# Altium project EinsyRetro.PrjPcb (part 2 of 2)

## Sheet Motor-X.SchDoc: Motor-X
size Letter; SheetNumber: 8; SheetTotal: 11
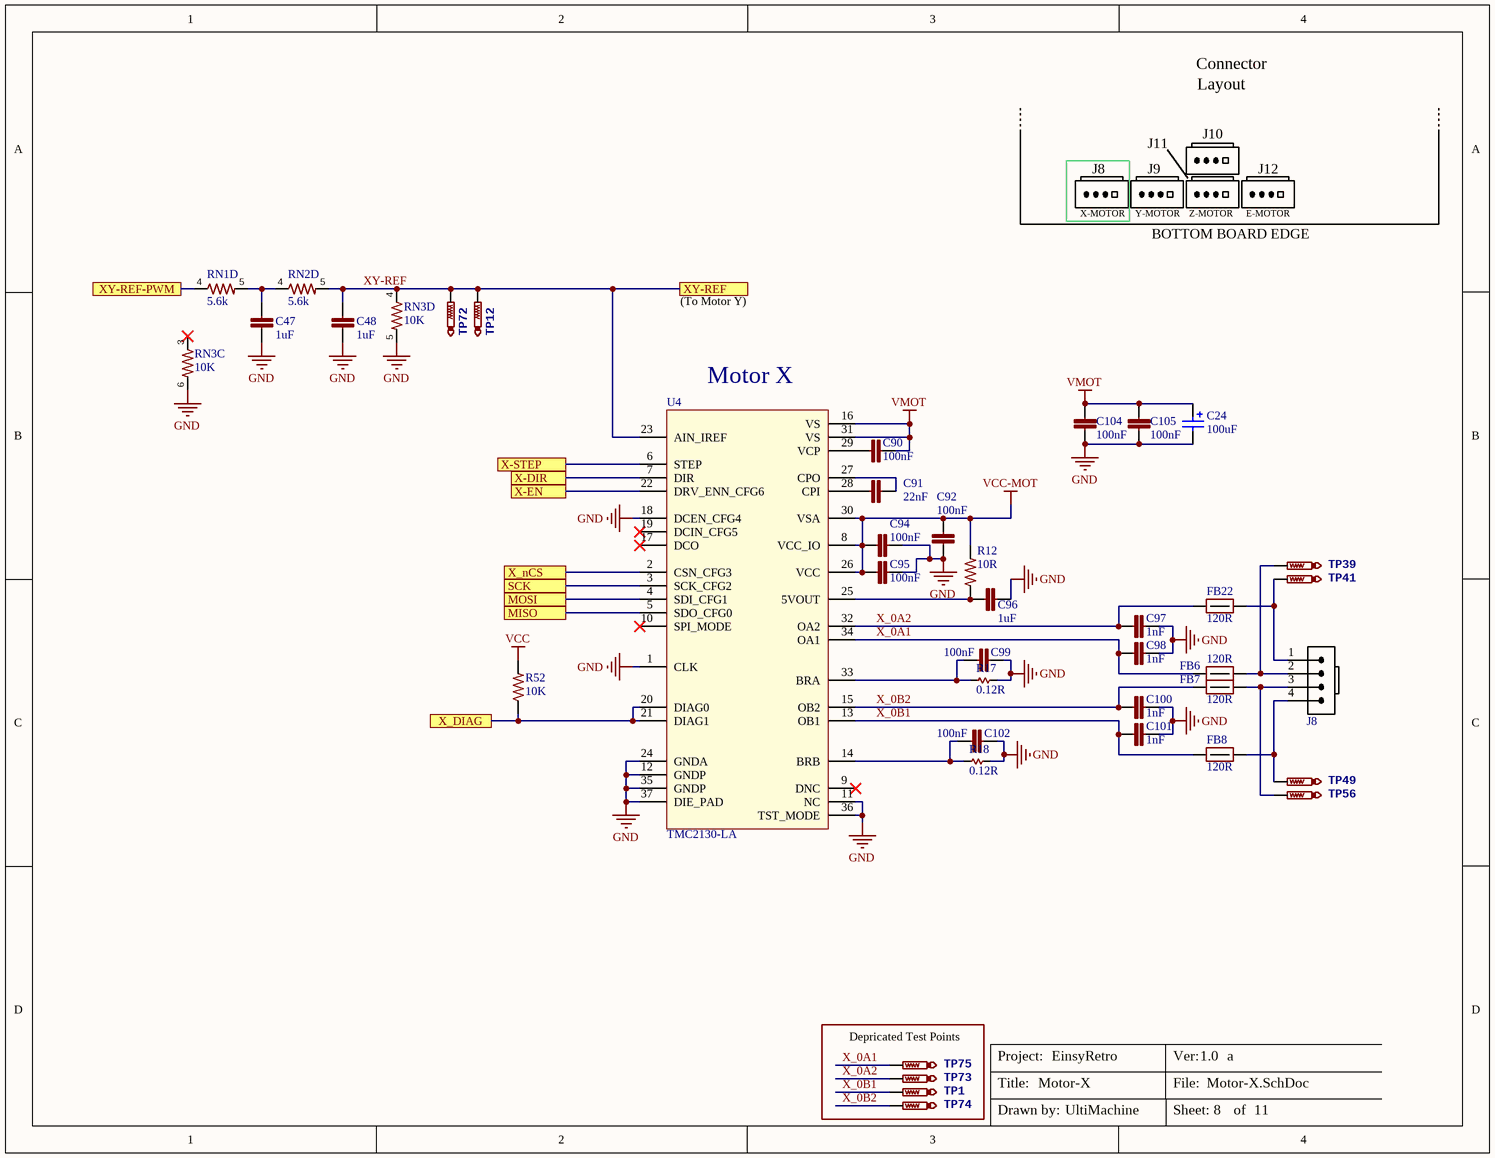
[diagram p6: Motor-X.SchDoc]

### Parts
C24  value 100uF  [CAP-ELEC-063063077]  (hidden comment: UWT1V101MCL1GS)
C47  1uF  [C0402]
C48  1uF  [C0402]
C90  100nF  [C0603]
C91  22nF  [C0402]
C92  100nF  [C0402]
C94  100nF  [C0402]
C95  100nF  [C0402]
C96  1uF  [C0402]
C97  1nF  [C0603]
C98  1nF  [C0603]
C99  100nF  [C0603]
C100  1nF  [C0603]
C101  1nF  [C0603]
C102  100nF  [C0603]
C104  100nF  [C0603]
C105  100nF  [C0603]
FB6  120R  [FB0603]
FB7  120R  [FB0603]
FB8  120R  [FB0603]
FB22  120R  [FB0603]
J8  Molex 0705430003  [4POL254 PIN-IN-PASTE]  (value not drawn)
R12  10R  [R0402]
R17  0.12R  [R1206]
R18  0.12R  [R1206]
R52  10K  [R0402]
RN1  5.6k  [CAY16]  (part D of 4)
RN2  5.6k  [CAY16]  (part D of 4)
RN3  10K  [CAY16]  (parts C,D of 4)
TP1  TestPoint  [TP1-27]  (value not drawn)  (no BOM)
TP12  TestPoint  [TP1-27]  (value not drawn)  (no BOM)
TP39  TestPoint  [TP1-27]  (value not drawn)  (no BOM)
TP41  TestPoint  [TP1-27]  (value not drawn)  (no BOM)
TP49  TestPoint  [TP1-27]  (value not drawn)  (no BOM)
TP56  TestPoint  [TP1-27]  (value not drawn)  (no BOM)
TP72  TestPoint  [TP1-27]  (value not drawn)  (no BOM)
TP73  TestPoint  [TP1-27]  (value not drawn)  (no BOM)
TP74  TestPoint  [TP1-27]  (value not drawn)  (no BOM)
TP75  TestPoint  [TP1-27]  (value not drawn)  (no BOM)
U4  TMC2130-LA  [QFN36-50P500X600X900_HS-37N]

### Blocks framed on the sheet
Depricated Test Points: TP1 TP73-TP75

### Ports
MISO, MOSI, SCK, X-DIR, X-EN, X-STEP, X_DIAG, X_nCS, XY-REF, XY-REF-PWM

### Nets
GND: C24.2 C47.2 C48.2 C92.1 C94.1 C95.1 C96.2 C97.2 C98.2 C99.1 C100.2 C101.2 C102.1 C104.1 C105.1 R17.2 R18.2 RN3.5 RN3.6 U4.1(CLK) U4.11(NC) U4.12(GNDP) U4.18(DCEN_CFG4) U4.24(GNDA) U4.35(GNDP) U4.36(TST_MODE) U4.37(DIE_PAD)
VCC: R52.2
VCC-MOT: C92.2 C94.2 C95.2 R12.2 U4.8(VCC_IO) U4.26(VCC) U4.30(VSA)
VMOT: C24.1 C90.2 C104.2 C105.2 U4.16(VS) U4.31(VS)
MISO: U4.5(SDO_CFG0) ; port MISO
MOSI: U4.4(SDI_CFG1) ; port MOSI
SCK: U4.3(SCK_CFG2) ; port SCK
X-DIR: U4.7(DIR) ; port X-DIR
X-EN: U4.22(DRV_ENN_CFG6) ; port X-EN
X-STEP: U4.6(STEP) ; port X-STEP
X_0A1: C98.1 FB6.1 TP75.TP U4.34(OA1)
X_0A2: C97.1 FB22.1 TP73.TP U4.32(OA2)
X_0B1: C101.1 FB8.1 TP1.TP U4.13(OB1)
X_0B2: C100.1 FB7.1 TP74.TP U4.15(OB2)
X_DIAG: R52.1 U4.20(DIAG0) U4.21(DIAG1) ; port X_DIAG
X_nCS: U4.2(CSN_CFG3) ; port X_nCS
XY-REF: C48.1 RN2.5 RN3.4 TP12.TP TP72.TP U4.23(AIN_IREF) ; port XY-REF
XY-REF-PWM: RN1.4 ; port XY-REF-PWM
NetC47_1: C47.1 RN1.5 RN2.4
NetC90_1: C90.1 U4.29(VCP)
NetC91_1: C91.1 U4.28(CPI)
NetC91_2: C91.2 U4.27(CPO)
NetC96_1: C96.1 R12.1 U4.25(5VOUT)
NetC99_2: C99.2 R17.1 U4.33(BRA)
NetC102_2: C102.2 R18.1 U4.14(BRB)
NetFB6_2: FB6.2 J8.2 TP39.TP
NetFB7_2: FB7.2 J8.3 TP56.TP
NetFB8_2: FB8.2 J8.4 TP49.TP
NetFB22_2: FB22.2 J8.1 TP41.TP

Not connected (* = marked no-connect by the designer): RN3 3(1)*; U4 9(DNC)* 10(SPI_MODE)* 17(DCO)* 19(DCIN_CFG5)*

### Notes on the sheet
- Connector
- Layout
- J11
- J10
- X-MOTOR
- J8
- Y-MOTOR
- J9
- Z-MOTOR
- E-MOTOR
- J12
- BOTTOM BOARD EDGE
- (To Motor Y)
- (near U4) Motor X
- Title:
- Project:
- File:
- Ver:
- Drawn by:
- Sheet:
- of

### Library data of the parts
C24 = UWT1V101MCL1GS: as C27 on sheet Power-SMPS; MANUFACTURER #: UWT1V101MCL1GS; DISTRIBUTOR #: 493-2203-2-ND; DISTRIBUTOR: Digi-Key; PART: 100uF
C47 C48 C96 = GRM155R60J105KE19D: as C16 on sheet USB-Serial; VALUE: 1uF; MANUFACTURER #: GRM155R60J105KE19D; DISTRIBUTOR #: 490-1320-2-ND; DISTRIBUTOR: Digi-Key; PART: 1uF
C90 C99 C102 C104 C105 = C0603C104K5RACTU: as C3 on sheet Power-SMPS; VALUE: 100nF; MANUFACTURER #: C0603C104K5RACTU; DISTRIBUTOR #: 399-5089-2-ND; DISTRIBUTOR: Digi-Key; PART: 100nF
C91 = GCM155R71H223KA55D: CAP CER 0402 22nF ±10% 50V X7R; Manufacturer: YAGEO; Part Description: 0.022µF ±10% 50V Ceramic Capacitor X7R 0402 (1005 Metric); EE_SPEC: 22nF 50V X7R 0402; Tolerance: +/- 10%; VALUE: 22nF; MANUFACTURER #: GCM155R71H223KA55D; DISTRIBUTOR #: 490-4763-2-ND; DISTRIBUTOR: Digi-Key; PART: 22nF
C92 C94 C95 = GRM155R71C104KA88D: as C6 on sheet MCU; VALUE: 100nF; MANUFACTURER #: GRM155R71C104KA88D; DISTRIBUTOR #: 490-3261-2-ND; DISTRIBUTOR: Digi-Key; PART: 100nF
C97 C98 C100 C101 = C0603C102K5RACTU: CAP CER 0603  1nF 50v 10% X7R; Manufacturer: Kemet; Part Description: 1000pF ±10% 50V Ceramic Capacitor X7R 0603 (1608 Metric); EE_SPEC: 1nF 50V X7R 0603; Tolerance: +/- 10%; VALUE: 1nF; MANUFACTURER #: C0603C102K5RACTU; DISTRIBUTOR #: 399-1082-2-ND; DISTRIBUTOR: Digi-Key; PART: 1nF
FB6-FB8 FB22 = FERRITE 120R 3A 0603: as FB4 on sheet Power-SMPS; DISTRIBUTOR #: 1276-6351-2-ND; DISTRIBUTOR: Digikey; PART: FERRITE 120R 3A 0603; PART DESCRIPTION: FERRITE BEAD 120 OHM 0603 1LN
J8 = Molex 0705430003 PIP: Molex 4 Pin Clip Connector - Pin In Paste footprint
R12 = RC0402FR-0710RL: RES SMD 10 OHM 1% 1/16W 0402; Manufacturer: Yageo; Part Description: 10 Ohm ±1% 0.063W, 1/16W Chip Resistor 0402 (1005 Metric) Moisture Resistant Thick Film; EE_SPEC: 10R 1% 0402; Tolerance: +/- 1%; VALUE: 10R; MANUFACTURER #: RC0402FR-0710RL; DISTRIBUTOR #: 311-10.0LRTR-ND; DISTRIBUTOR: Digi-Key; PART: 10R
R17 R18 = 0.12R 1% 1206: RES 0.12 OHM 1% 1/2W 1206; MANUFACTURER #: RL1206FR-7W0R12L; Part Description: 120 mOhms ±1% 0.5W, 1/2W Chip Resistor 1206 (3216 Metric) Automotive AEC-Q200, Current Sense, Moisture Resistant Thick Film; Tolerance: +/- 1%; DISTRIBUTOR #: 311-.12LYTR-ND; DISTRIBUTOR: Digi-Key; EE_SPEC: 0.12R 1% 1206; PART: 0.12R; VALUE: 0.12R
R52 = RC0402FR-0710KP: as R46 on sheet MCU; VALUE: 10K; MANUFACTURER #: RC0402FR-0710KP; DISTRIBUTOR #: YAG1249TR-ND; DISTRIBUTOR: Digi-Key; TOLERANCE: 1%
RN1 RN2 = 5.6k x 4 5% 1206: RES ARRAY 4 RES 5.6K OHM 1206; Manufacturer: Bourns; MANUFACTURER #: CAY16-562J4LF; Part Description: 5.6k Ohm ±5% 62.5mW Power Per Element Isolated Resistor Network/Array ±200ppm/°C 1206 (3216 Metric), Convex, Long Side Terminals; Tolerance: +/- 5%; VALUE: 5.6k; DISTRIBUTOR #: CAY16-562J4LFCT-ND; DISTRIBUTOR: Digi-Key; EE_SPEC: 5.6k x 4 5% 1206; PART: 5.6k
RN3 = CAY16-103J4LF: RES ARRAY 4 RES 10K 1206 62.5mW 5%; Manufacturer: Bourns; Part Description: 10k Ohm ±5% 62.5mW Power Per Element Isolated Resistor Network/Array ±200ppm/°C 1206 (3216 Metric), Convex, Long Side Terminals; EE_SPEC: 10k 5% Array_x_4; Tolerance: +/- 5%; VALUE: 10K; MANUFACTURER #: CAY16-103J4LF; DISTRIBUTOR #: CAY16-103J4LFTR-ND; DISTRIBUTOR: Digi-Key; PART: 10K
TP1 TP12 TP39 TP41 TP49 TP56 TP72-TP75 = TestPoint: Test Point
U4 = TMC2130-LA-T: IC STEPPER MOTOR DVR SPI 36QFN; Manufacturer: Trinamic; Part Description: Bipolar Motor Driver Power MOSFET SPI, Step/Direction 36-QFN (5x6); EE_SPEC: 46V 1.2A 1/256 Step; Tolerance: NA; DISTRIBUTOR #: 1460-1130-2-ND; DISTRIBUTOR: Digi-Key; MANUFACTURER #: TMC2130-LA-T; PART: TMC2130; VALUE: TMC2130

## Sheet Motor-Y.SchDoc: Motor-Y
size Letter; SheetNumber: 9; SheetTotal: 11
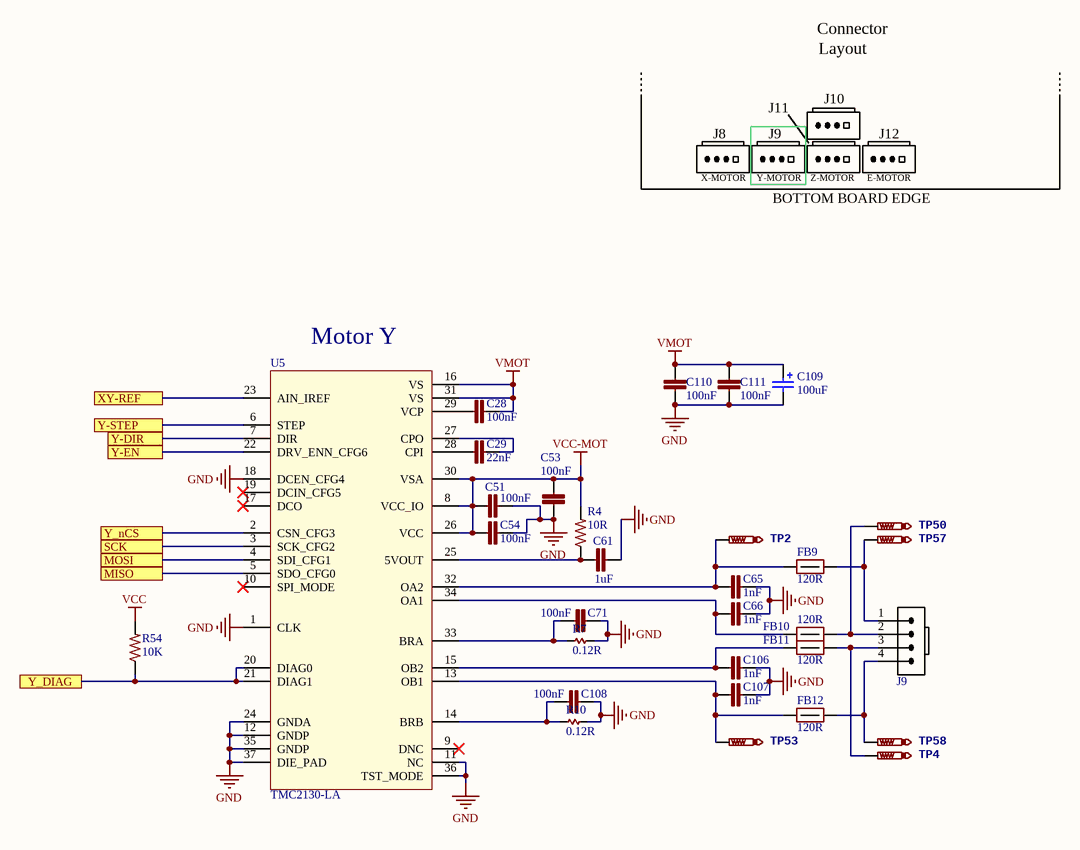
[diagram p7: Motor-Y.SchDoc]

### Parts
C28  100nF  [C0603]
C29  22nF  [C0402]
C51  100nF  [C0402]
C53  100nF  [C0402]
C54  100nF  [C0402]
C61  1uF  [C0402]
C65  1nF  [C0603]
C66  1nF  [C0603]
C71  100nF  [C0603]
C106  1nF  [C0603]
C107  1nF  [C0603]
C108  100nF  [C0603]
C109  value 100uF  [CAP-ELEC-063063077]  (hidden comment: UWT1V101MCL1GS)
C110  100nF  [C0603]
C111  100nF  [C0603]
FB9  120R  [FB0603]
FB10  120R  [FB0603]
FB11  120R  [FB0603]
FB12  120R  [FB0603]
J9  Molex 0705430003  [4POL254 PIN-IN-PASTE]  (value not drawn)
R4  10R  [R0402]
R7  0.12R  [R1206]
R10  0.12R  [R1206]
R54  10K  [R0402]
TP2  TestPoint  [TP1-27]  (value not drawn)  (no BOM)
TP4  TestPoint  [TP1-27]  (value not drawn)  (no BOM)
TP50  TestPoint  [TP1-27]  (value not drawn)  (no BOM)
TP53  TestPoint  [TP1-27]  (value not drawn)  (no BOM)
TP57  TestPoint  [TP1-27]  (value not drawn)  (no BOM)
TP58  TestPoint  [TP1-27]  (value not drawn)  (no BOM)
U5  TMC2130-LA  [QFN36-50P500X600X900_HS-37N]

### Ports
MISO, MOSI, SCK, XY-REF, Y-DIR, Y-EN, Y-STEP, Y_DIAG, Y_nCS

### Nets
GND: C51.1 C53.1 C54.1 C61.2 C65.2 C66.2 C71.1 C106.2 C107.2 C108.1 C109.2 C110.1 C111.1 R7.2 R10.2 U5.1(CLK) U5.11(NC) U5.12(GNDP) U5.18(DCEN_CFG4) U5.24(GNDA) U5.35(GNDP) U5.36(TST_MODE) U5.37(DIE_PAD)
VCC: R54.2
VCC-MOT: C51.2 C53.2 C54.2 R4.2 U5.8(VCC_IO) U5.26(VCC) U5.30(VSA)
VMOT: C28.2 C109.1 C110.2 C111.2 U5.16(VS) U5.31(VS)
MISO: U5.5(SDO_CFG0) ; port MISO
MOSI: U5.4(SDI_CFG1) ; port MOSI
SCK: U5.3(SCK_CFG2) ; port SCK
XY-REF: U5.23(AIN_IREF) ; port XY-REF
Y-DIR: U5.7(DIR) ; port Y-DIR
Y-EN: U5.22(DRV_ENN_CFG6) ; port Y-EN
Y-STEP: U5.6(STEP) ; port Y-STEP
Y_DIAG: R54.1 U5.20(DIAG0) U5.21(DIAG1) ; port Y_DIAG
Y_nCS: U5.2(CSN_CFG3) ; port Y_nCS
NetC28_1: C28.1 U5.29(VCP)
NetC29_1: C29.1 U5.28(CPI)
NetC29_2: C29.2 U5.27(CPO)
NetC61_1: C61.1 R4.1 U5.25(5VOUT)
NetC65_1: C65.1 FB9.1 TP2.TP U5.32(OA2)
NetC66_1: C66.1 FB10.1 U5.34(OA1)
NetC71_2: C71.2 R7.1 U5.33(BRA)
NetC106_1: C106.1 FB11.1 U5.15(OB2)
NetC107_1: C107.1 FB12.1 TP53.TP U5.13(OB1)
NetC108_2: C108.2 R10.1 U5.14(BRB)
NetFB9_2: FB9.2 J9.1 TP57.TP
NetFB10_2: FB10.2 J9.2 TP50.TP
NetFB11_2: FB11.2 J9.3 TP4.TP
NetFB12_2: FB12.2 J9.4 TP58.TP

Not connected (* = marked no-connect by the designer): U5 9(DNC)* 10(SPI_MODE)* 17(DCO)* 19(DCIN_CFG5)*

### Notes on the sheet
- Connector
- Layout
- J8
- J9
- J11
- J10
- J12
- X-MOTOR
- Y-MOTOR
- BOTTOM BOARD EDGE
- Z-MOTOR
- E-MOTOR
- (near U5) Motor Y
- Title:
- Project:
- File:
- Ver:
- Drawn by:
- Sheet:
- of

### Library data of the parts
C28 C71 C108 C110 C111 = C0603C104K5RACTU: as C3 on sheet Power-SMPS; VALUE: 100nF; MANUFACTURER #: C0603C104K5RACTU; DISTRIBUTOR #: 399-5089-2-ND; DISTRIBUTOR: Digi-Key; PART: 100nF
C29 = GCM155R71H223KA55D: as C91 on sheet Motor-X; VALUE: 22nF; MANUFACTURER #: GCM155R71H223KA55D; DISTRIBUTOR #: 490-4763-2-ND; DISTRIBUTOR: Digi-Key; PART: 22nF
C51 C53 C54 = GRM155R71C104KA88D: as C6 on sheet MCU; VALUE: 100nF; MANUFACTURER #: GRM155R71C104KA88D; DISTRIBUTOR #: 490-3261-2-ND; DISTRIBUTOR: Digi-Key; PART: 100nF
C61 = GRM155R60J105KE19D: as C16 on sheet USB-Serial; VALUE: 1uF; MANUFACTURER #: GRM155R60J105KE19D; DISTRIBUTOR #: 490-1320-2-ND; DISTRIBUTOR: Digi-Key; PART: 1uF
C65 C66 C106 C107 = C0603C102K5RACTU: as C97 on sheet Motor-X; VALUE: 1nF; MANUFACTURER #: C0603C102K5RACTU; DISTRIBUTOR #: 399-1082-2-ND; DISTRIBUTOR: Digi-Key; PART: 1nF
C109 = UWT1V101MCL1GS: as C27 on sheet Power-SMPS; MANUFACTURER #: UWT1V101MCL1GS; DISTRIBUTOR #: 493-2203-2-ND; DISTRIBUTOR: Digi-Key; PART: 100uF
FB9-FB12 = FERRITE 120R 3A 0603: as FB4 on sheet Power-SMPS; DISTRIBUTOR #: 1276-6351-2-ND; DISTRIBUTOR: Digikey; PART: FERRITE 120R 3A 0603; PART DESCRIPTION: FERRITE BEAD 120 OHM 0603 1LN
J9 = Molex 0705430003 PIP: as J8 on sheet Motor-X
R4 = RC0402FR-0710RL: as R12 on sheet Motor-X; VALUE: 10R; MANUFACTURER #: RC0402FR-0710RL; DISTRIBUTOR #: 311-10.0LRTR-ND; DISTRIBUTOR: Digi-Key; PART: 10R
R7 R10 = 0.12R 1% 1206: as R17 on sheet Motor-X; DISTRIBUTOR #: 311-.12LYTR-ND; DISTRIBUTOR: Digi-Key; EE_SPEC: 0.12R 1% 1206; PART: 0.12R; VALUE: 0.12R
R54 = RC0402FR-0710KP: as R46 on sheet MCU; VALUE: 10K; MANUFACTURER #: RC0402FR-0710KP; DISTRIBUTOR #: YAG1249TR-ND; DISTRIBUTOR: Digi-Key; TOLERANCE: 1%
TP2 TP4 TP50 TP53 TP57 TP58 = TestPoint: Test Point
U5 = TMC2130-LA-T: as U4 on sheet Motor-X; DISTRIBUTOR #: 1460-1130-2-ND; DISTRIBUTOR: Digi-Key; MANUFACTURER #: TMC2130-LA-T; PART: TMC2130; VALUE: TMC2130

## Sheet Motor-Z.SchDoc: Motor-Z
size Letter; SheetNumber: 10; SheetTotal: 11
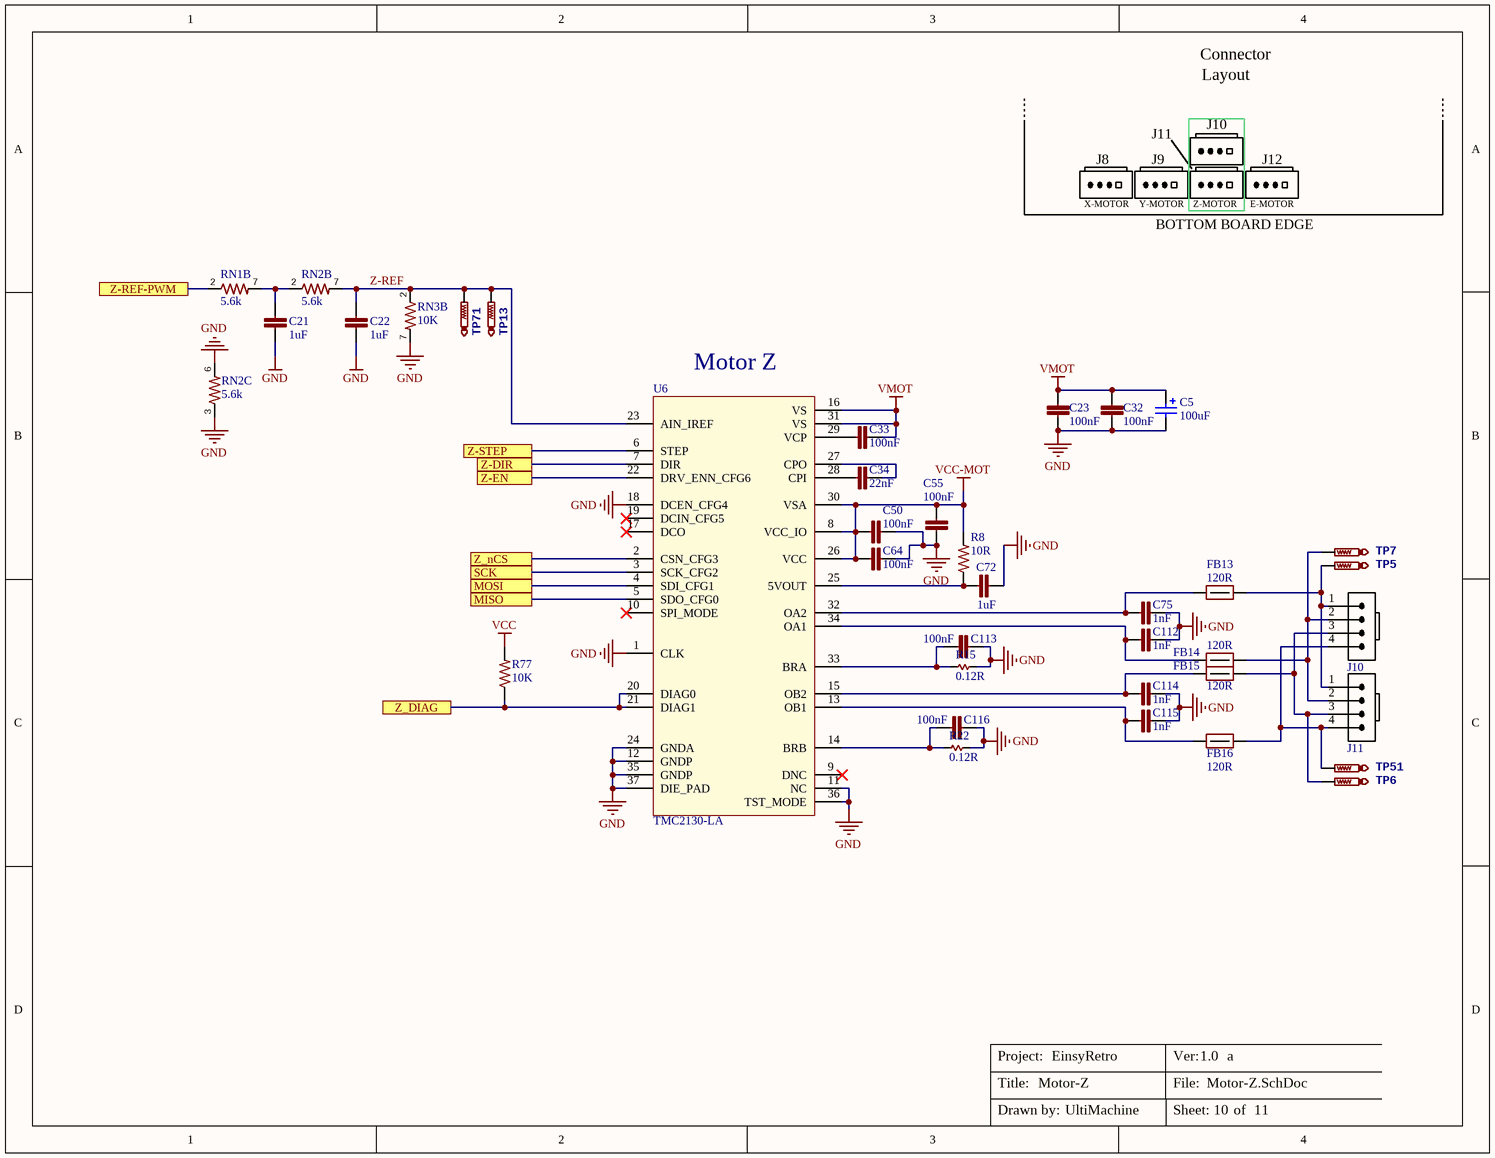
[diagram p8: Motor-Z.SchDoc]

### Parts
C5  value 100uF  [CAP-ELEC-063063077]  (hidden comment: UWT1V101MCL1GS)
C21  1uF  [C0402]
C22  1uF  [C0402]
C23  100nF  [C0603]
C32  100nF  [C0603]
C33  100nF  [C0603]
C34  22nF  [C0402]
C50  100nF  [C0402]
C55  100nF  [C0402]
C64  100nF  [C0402]
C72  1uF  [C0402]
C75  1nF  [C0603]
C112  1nF  [C0603]
C113  100nF  [C0603]
C114  1nF  [C0603]
C115  1nF  [C0603]
C116  100nF  [C0603]
FB13  120R  [FB0603]
FB14  120R  [FB0603]
FB15  120R  [FB0603]
FB16  120R  [FB0603]
J10  Molex 0705430003  [4POL254 PIN-IN-PASTE]  (value not drawn)
J11  Molex 0705430003  [4POL254 PIN-IN-PASTE]  (value not drawn)
R8  10R  [R0402]
R15  0.12R  [R1206]
R22  0.12R  [R1206]
R77  10K  [R0402]
RN1  5.6k  [CAY16]  (part B of 4)
RN2  5.6k  [CAY16]  (parts B,C of 4)
RN3  10K  [CAY16]  (part B of 4)
TP5  TestPoint  [TP1-27]  (value not drawn)  (no BOM)
TP6  TestPoint  [TP1-27]  (value not drawn)  (no BOM)
TP7  TestPoint  [TP1-27]  (value not drawn)  (no BOM)
TP13  TestPoint  [TP1-27]  (value not drawn)  (no BOM)
TP51  TestPoint  [TP1-27]  (value not drawn)  (no BOM)
TP71  TestPoint  [TP1-27]  (value not drawn)  (no BOM)
U6  TMC2130-LA  [QFN36-50P500X600X900_HS-37N]

### Ports
MISO, MOSI, SCK, Z-DIR, Z-EN, Z-REF-PWM, Z-STEP, Z_DIAG, Z_nCS

### Nets
GND: C5.2 C21.2 C22.2 C23.1 C32.1 C50.1 C55.1 C64.1 C72.2 C75.2 C112.2 C113.1 C114.2 C115.2 C116.1 R15.2 R22.2 RN2.3 RN2.6 RN3.7 U6.1(CLK) U6.11(NC) U6.12(GNDP) U6.18(DCEN_CFG4) U6.24(GNDA) U6.35(GNDP) U6.36(TST_MODE) U6.37(DIE_PAD)
VCC: R77.2
VCC-MOT: C50.2 C55.2 C64.2 R8.2 U6.8(VCC_IO) U6.26(VCC) U6.30(VSA)
VMOT: C5.1 C23.2 C32.2 C33.2 U6.16(VS) U6.31(VS)
MISO: U6.5(SDO_CFG0) ; port MISO
MOSI: U6.4(SDI_CFG1) ; port MOSI
SCK: U6.3(SCK_CFG2) ; port SCK
Z-DIR: U6.7(DIR) ; port Z-DIR
Z-EN: U6.22(DRV_ENN_CFG6) ; port Z-EN
Z-REF: C22.1 RN2.7 RN3.2 TP13.TP TP71.TP U6.23(AIN_IREF)
Z-REF-PWM: RN1.2 ; port Z-REF-PWM
Z-STEP: U6.6(STEP) ; port Z-STEP
Z_DIAG: R77.1 U6.20(DIAG0) U6.21(DIAG1) ; port Z_DIAG
Z_nCS: U6.2(CSN_CFG3) ; port Z_nCS
NetC21_1: C21.1 RN1.7 RN2.2
NetC33_1: C33.1 U6.29(VCP)
NetC34_1: C34.1 U6.28(CPI)
NetC34_2: C34.2 U6.27(CPO)
NetC72_1: C72.1 R8.1 U6.25(5VOUT)
NetC75_1: C75.1 FB13.1 U6.32(OA2)
NetC112_1: C112.1 FB14.1 U6.34(OA1)
NetC113_2: C113.2 R15.1 U6.33(BRA)
NetC114_1: C114.1 FB15.1 U6.15(OB2)
NetC115_1: C115.1 FB16.1 U6.13(OB1)
NetC116_2: C116.2 R22.1 U6.14(BRB)
NetFB13_2: FB13.2 J10.1 J11.1 TP5.TP
NetFB14_2: FB14.2 J10.2 J11.2 TP7.TP
NetFB15_2: FB15.2 J10.3 J11.3 TP6.TP
NetFB16_2: FB16.2 J10.4 J11.4 TP51.TP

Not connected (* = marked no-connect by the designer): U6 9(DNC)* 10(SPI_MODE)* 17(DCO)* 19(DCIN_CFG5)*

### Notes on the sheet
- Connector
- Layout
- J8
- J9
- J11
- J10
- J12
- X-MOTOR
- Y-MOTOR
- BOTTOM BOARD EDGE
- Z-MOTOR
- E-MOTOR
- (near U6) Motor Z
- Title:
- Project:
- File:
- Ver:
- Drawn by:
- Sheet:
- of

### Library data of the parts
C5 = UWT1V101MCL1GS: CAP ALUM 100UF 35V 20% SMD; Manufacturer: Nichicon; Part Description: 100µF 35V Aluminum Capacitors Radial, Can - SMD 1000 Hrs @ 105°C; EE_SPEC: 100uF 35V Al-El; Tolerance: +/- 20%; MANUFACTURER #: UWT1V101MCL1GS; DISTRIBUTOR #: 493-2203-2-ND; DISTRIBUTOR: Digi-Key; PART: 100uF
C21 C22 C72 = GRM155R60J105KE19D: CAP CER 0402 1uF 6.3V 10% X5R; Manufacturer: Murata; Part Description: 1µF ±10% 6.3V Ceramic Capacitor X5R 0402 (1005 Metric); EE_SPEC: 1uF 6.3V X5R 0402; Tolerance: +/- 10%; VALUE: 1uF; MANUFACTURER #: GRM155R60J105KE19D; DISTRIBUTOR #: 490-1320-2-ND; DISTRIBUTOR: Digi-Key; PART: 1uF
C23 C32 C33 C113 C116 = C0603C104K5RACTU: CAP CER 0603 100nF 50V 10% X7R; Manufacturer: Kemet; Part Description: 0.1µF ±10% 50V Ceramic Capacitor X7R 0603 (1608 Metric); EE_SPEC: 100nF 50V X7R 0603; Tolerance: +/- 10%; VALUE: 100nF; MANUFACTURER #: C0603C104K5RACTU; DISTRIBUTOR #: 399-5089-2-ND; DISTRIBUTOR: Digi-Key; PART: 100nF
C34 = GCM155R71H223KA55D: CAP CER 0402 22nF ±10% 50V X7R; Manufacturer: YAGEO; Part Description: 0.022µF ±10% 50V Ceramic Capacitor X7R 0402 (1005 Metric); EE_SPEC: 22nF 50V X7R 0402; Tolerance: +/- 10%; VALUE: 22nF; MANUFACTURER #: GCM155R71H223KA55D; DISTRIBUTOR #: 490-4763-2-ND; DISTRIBUTOR: Digi-Key; PART: 22nF
C50 C55 C64 = GRM155R71C104KA88D: CAP CER 0402 100nF 16V 10% X7R; Manufacturer: Murata; Part Description: 0.10µF ±10% 16V Ceramic Capacitor X7R 0402 (1005 Metric); EE_SPEC: 100nF 16V X7R 0402; Tolerance: +/- 10%; VALUE: 100nF; MANUFACTURER #: GRM155R71C104KA88D; DISTRIBUTOR #: 490-3261-2-ND; DISTRIBUTOR: Digi-Key; PART: 100nF
C75 C112 C114 C115 = C0603C102K5RACTU: CAP CER 0603  1nF 50v 10% X7R; Manufacturer: Kemet; Part Description: 1000pF ±10% 50V Ceramic Capacitor X7R 0603 (1608 Metric); EE_SPEC: 1nF 50V X7R 0603; Tolerance: +/- 10%; VALUE: 1nF; MANUFACTURER #: C0603C102K5RACTU; DISTRIBUTOR #: 399-1082-2-ND; DISTRIBUTOR: Digi-Key; PART: 1nF
FB13-FB16 = FERRITE 120R 3A 0603: FERRITE BEAD 120 OHM 0603 1LN; MANUFACTURER: Samsung; MANUFACTURER #: CIS10P121AC; VALUE: 120Rfb; TOLERANCE: -NA-; EE_SPEC: 3A; DISTRIBUTOR #: 1276-6351-2-ND; DISTRIBUTOR: Digikey; PART: FERRITE 120R 3A 0603; PART DESCRIPTION: FERRITE BEAD 120 OHM 0603 1LN
J10 J11 = Molex 0705430003 PIP: Molex 4 Pin Clip Connector - Pin In Paste footprint
R8 = RC0402FR-0710RL: RES SMD 10 OHM 1% 1/16W 0402; Manufacturer: Yageo; Part Description: 10 Ohm ±1% 0.063W, 1/16W Chip Resistor 0402 (1005 Metric) Moisture Resistant Thick Film; EE_SPEC: 10R 1% 0402; Tolerance: +/- 1%; VALUE: 10R; MANUFACTURER #: RC0402FR-0710RL; DISTRIBUTOR #: 311-10.0LRTR-ND; DISTRIBUTOR: Digi-Key; PART: 10R
R15 R22 = 0.12R 1% 1206: RES 0.12 OHM 1% 1/2W 1206; MANUFACTURER #: RL1206FR-7W0R12L; Part Description: 120 mOhms ±1% 0.5W, 1/2W Chip Resistor 1206 (3216 Metric) Automotive AEC-Q200, Current Sense, Moisture Resistant Thick Film; Tolerance: +/- 1%; DISTRIBUTOR #: 311-.12LYTR-ND; DISTRIBUTOR: Digi-Key; EE_SPEC: 0.12R 1% 1206; PART: 0.12R; VALUE: 0.12R
R77 = RC0402FR-0710KP: RES SMD 10K OHM 1% 1/16W 0402; MANUFACTURER: Yageo; PART: 10k 1% 0402; PART DESCRIPTION: 10k Ohm ±1% 0.063W, 1/16W Chip Resistor 0402 (1005 Metric) Moisture Resistant Thick Film; EE_SPEC: 10k 1% 0402 1/16W; VALUE: 10K; MANUFACTURER #: RC0402FR-0710KP; DISTRIBUTOR #: YAG1249TR-ND; DISTRIBUTOR: Digi-Key; TOLERANCE: 1%
RN1 RN2 = 5.6k x 4 5% 1206: RES ARRAY 4 RES 5.6K OHM 1206; Manufacturer: Bourns; MANUFACTURER #: CAY16-562J4LF; Part Description: 5.6k Ohm ±5% 62.5mW Power Per Element Isolated Resistor Network/Array ±200ppm/°C 1206 (3216 Metric), Convex, Long Side Terminals; Tolerance: +/- 5%; VALUE: 5.6k; DISTRIBUTOR #: CAY16-562J4LFCT-ND; DISTRIBUTOR: Digi-Key; EE_SPEC: 5.6k x 4 5% 1206; PART: 5.6k
RN3 = CAY16-103J4LF: RES ARRAY 4 RES 10K 1206 62.5mW 5%; Manufacturer: Bourns; Part Description: 10k Ohm ±5% 62.5mW Power Per Element Isolated Resistor Network/Array ±200ppm/°C 1206 (3216 Metric), Convex, Long Side Terminals; EE_SPEC: 10k 5% Array_x_4; Tolerance: +/- 5%; VALUE: 10K; MANUFACTURER #: CAY16-103J4LF; DISTRIBUTOR #: CAY16-103J4LFTR-ND; DISTRIBUTOR: Digi-Key; PART: 10K
TP5-TP7 TP13 TP51 TP71 = TestPoint: Test Point
U6 = TMC2130-LA-T: IC STEPPER MOTOR DVR SPI 36QFN; Manufacturer: Trinamic; Part Description: Bipolar Motor Driver Power MOSFET SPI, Step/Direction 36-QFN (5x6); EE_SPEC: 46V 1.2A 1/256 Step; Tolerance: NA; DISTRIBUTOR #: 1460-1130-2-ND; DISTRIBUTOR: Digi-Key; MANUFACTURER #: TMC2130-LA-T; PART: TMC2130; VALUE: TMC2130

## Sheet Motor-E.SchDoc: Motor-E
size Letter; SheetNumber: 11; SheetTotal: 11
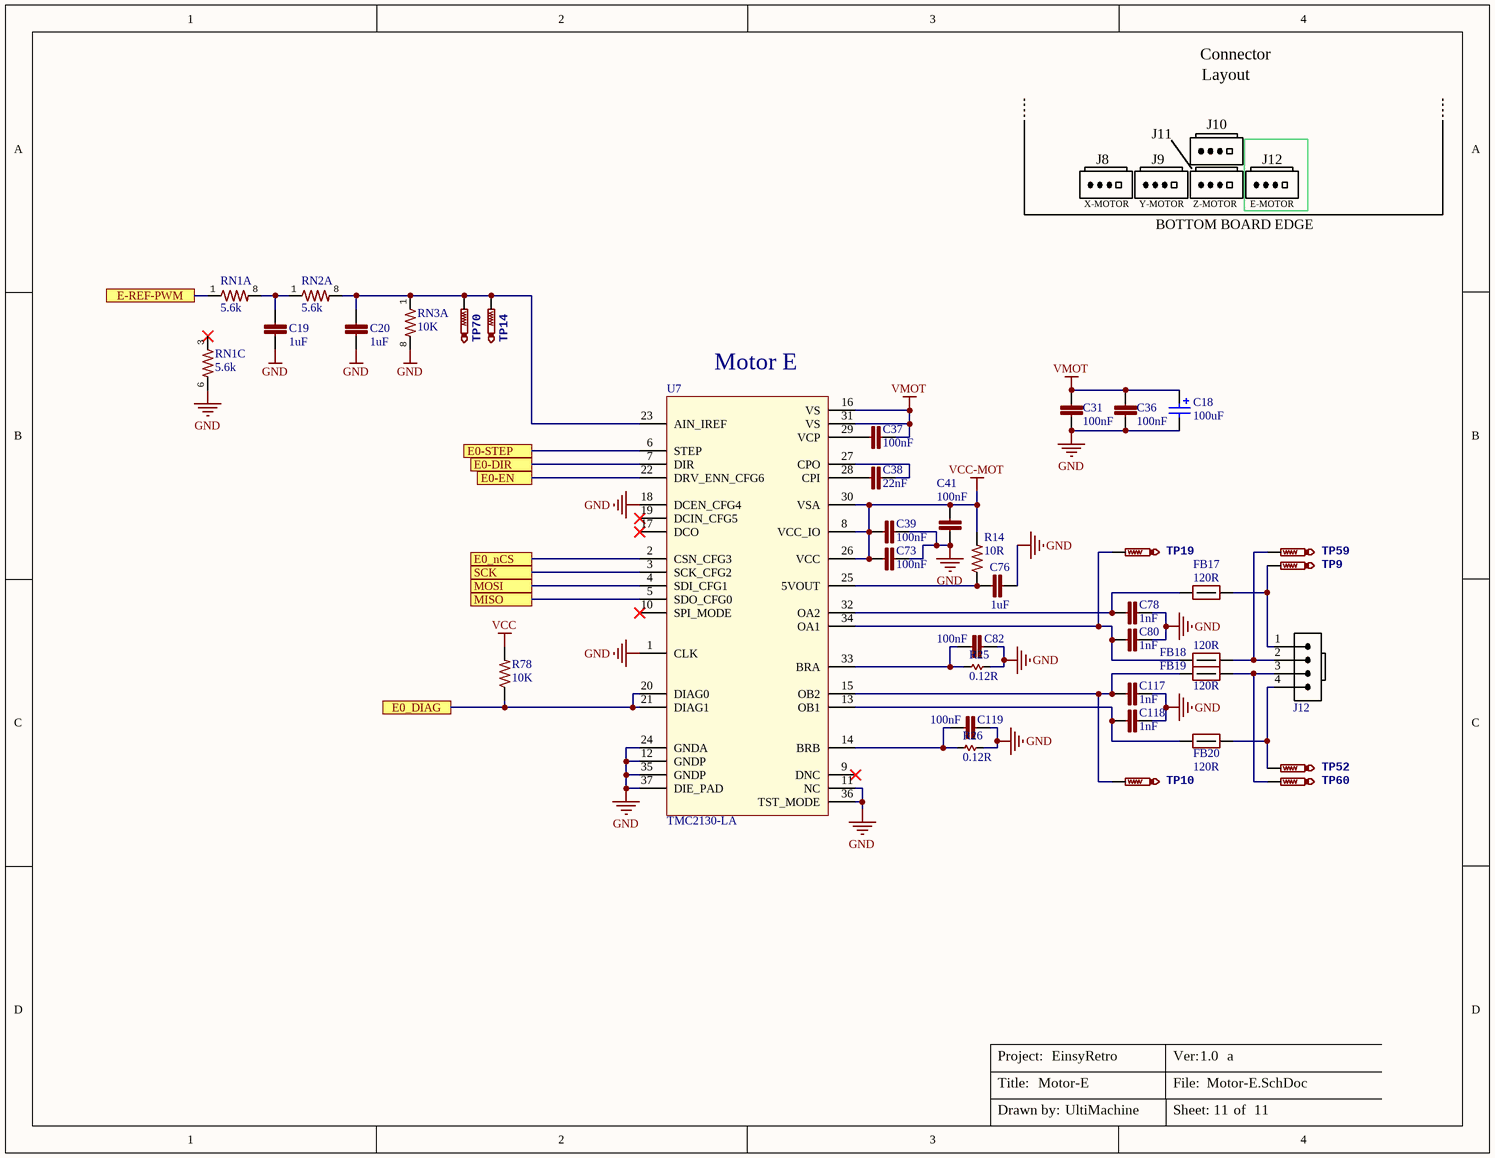
[diagram p9: Motor-E.SchDoc]

### Parts
C18  value 100uF  [CAP-ELEC-063063077]  (hidden comment: UWT1V101MCL1GS)
C19  1uF  [C0402]
C20  1uF  [C0402]
C31  100nF  [C0603]
C36  100nF  [C0603]
C37  100nF  [C0603]
C38  22nF  [C0402]
C39  100nF  [C0402]
C41  100nF  [C0402]
C73  100nF  [C0402]
C76  1uF  [C0402]
C78  1nF  [C0603]
C80  1nF  [C0603]
C82  100nF  [C0603]
C117  1nF  [C0603]
C118  1nF  [C0603]
C119  100nF  [C0603]
FB17  120R  [FB0603]
FB18  120R  [FB0603]
FB19  120R  [FB0603]
FB20  120R  [FB0603]
J12  Molex 0705430003  [4POL254 PIN-IN-PASTE]  (value not drawn)
R14  10R  [R0402]
R25  0.12R  [R1206]
R26  0.12R  [R1206]
R78  10K  [R0402]
RN1  5.6k  [CAY16]  (parts A,C of 4)
RN2  5.6k  [CAY16]  (part A of 4)
RN3  10K  [CAY16]  (part A of 4)
TP9  TestPoint  [TP1-27]  (value not drawn)  (no BOM)
TP10  TestPoint  [TP1-27]  (value not drawn)  (no BOM)
TP14  TestPoint  [TP1-27]  (value not drawn)  (no BOM)
TP19  TestPoint  [TP1-27]  (value not drawn)  (no BOM)
TP52  TestPoint  [TP1-27]  (value not drawn)  (no BOM)
TP59  TestPoint  [TP1-27]  (value not drawn)  (no BOM)
TP60  TestPoint  [TP1-27]  (value not drawn)  (no BOM)
TP70  TestPoint  [TP1-27]  (value not drawn)  (no BOM)
U7  TMC2130-LA  [QFN36-50P500X600X900_HS-37N]

### Ports
E0-DIR, E0-EN, E0-STEP, E0_DIAG, E0_nCS, E-REF-PWM, MISO, MOSI, SCK

### Nets
GND: C18.2 C19.2 C20.2 C31.1 C36.1 C39.1 C41.1 C73.1 C76.2 C78.2 C80.2 C82.1 C117.2 C118.2 C119.1 R25.2 R26.2 RN1.6 RN3.8 U7.1(CLK) U7.11(NC) U7.12(GNDP) U7.18(DCEN_CFG4) U7.24(GNDA) U7.35(GNDP) U7.36(TST_MODE) U7.37(DIE_PAD)
VCC: R78.2
VCC-MOT: C39.2 C41.2 C73.2 R14.2 U7.8(VCC_IO) U7.26(VCC) U7.30(VSA)
VMOT: C18.1 C31.2 C36.2 C37.2 U7.16(VS) U7.31(VS)
E0-DIR: U7.7(DIR) ; port E0-DIR
E0-EN: U7.22(DRV_ENN_CFG6) ; port E0-EN
E0-STEP: U7.6(STEP) ; port E0-STEP
E0_DIAG: R78.1 U7.20(DIAG0) U7.21(DIAG1) ; port E0_DIAG
E0_nCS: U7.2(CSN_CFG3) ; port E0_nCS
E-REF-PWM: RN1.1 ; port E-REF-PWM
MISO: U7.5(SDO_CFG0) ; port MISO
MOSI: U7.4(SDI_CFG1) ; port MOSI
SCK: U7.3(SCK_CFG2) ; port SCK
NetC19_1: C19.1 RN1.8 RN2.1
NetC20_1: C20.1 RN2.8 RN3.1 TP14.TP TP70.TP U7.23(AIN_IREF)
NetC37_1: C37.1 U7.29(VCP)
NetC38_1: C38.1 U7.28(CPI)
NetC38_2: C38.2 U7.27(CPO)
NetC76_1: C76.1 R14.1 U7.25(5VOUT)
NetC78_1: C78.1 FB17.1 U7.32(OA2)
NetC80_1: C80.1 FB18.1 TP19.TP U7.34(OA1)
NetC82_2: C82.2 R25.1 U7.33(BRA)
NetC117_1: C117.1 FB19.1 TP10.TP U7.15(OB2)
NetC118_1: C118.1 FB20.1 U7.13(OB1)
NetC119_2: C119.2 R26.1 U7.14(BRB)
NetFB17_2: FB17.2 J12.1 TP9.TP
NetFB18_2: FB18.2 J12.2 TP59.TP
NetFB19_2: FB19.2 J12.3 TP60.TP
NetFB20_2: FB20.2 J12.4 TP52.TP

Not connected (* = marked no-connect by the designer): RN1 3(1)*; U7 9(DNC)* 10(SPI_MODE)* 17(DCO)* 19(DCIN_CFG5)*

### Notes on the sheet
- Connector
- Layout
- J8
- J9
- J11
- J10
- J12
- X-MOTOR
- Y-MOTOR
- BOTTOM BOARD EDGE
- Z-MOTOR
- E-MOTOR
- (near U7) Motor E
- Title:
- Project:
- File:
- Ver:
- Drawn by:
- Sheet:
- of

### Library data of the parts
C18 = UWT1V101MCL1GS: as C5 on sheet Motor-Z; MANUFACTURER #: UWT1V101MCL1GS; DISTRIBUTOR #: 493-2203-2-ND; DISTRIBUTOR: Digi-Key; PART: 100uF
C19 C20 C76 = GRM155R60J105KE19D: as C21 on sheet Motor-Z; VALUE: 1uF; MANUFACTURER #: GRM155R60J105KE19D; DISTRIBUTOR #: 490-1320-2-ND; DISTRIBUTOR: Digi-Key; PART: 1uF
C31 C36 C37 C82 C119 = C0603C104K5RACTU: as C23 on sheet Motor-Z; VALUE: 100nF; MANUFACTURER #: C0603C104K5RACTU; DISTRIBUTOR #: 399-5089-2-ND; DISTRIBUTOR: Digi-Key; PART: 100nF
C38 = GCM155R71H223KA55D: as C34 on sheet Motor-Z; VALUE: 22nF; MANUFACTURER #: GCM155R71H223KA55D; DISTRIBUTOR #: 490-4763-2-ND; DISTRIBUTOR: Digi-Key; PART: 22nF
C39 C41 C73 = GRM155R71C104KA88D: as C50 on sheet Motor-Z; VALUE: 100nF; MANUFACTURER #: GRM155R71C104KA88D; DISTRIBUTOR #: 490-3261-2-ND; DISTRIBUTOR: Digi-Key; PART: 100nF
C78 C80 C117 C118 = C0603C102K5RACTU: as C75 on sheet Motor-Z; VALUE: 1nF; MANUFACTURER #: C0603C102K5RACTU; DISTRIBUTOR #: 399-1082-2-ND; DISTRIBUTOR: Digi-Key; PART: 1nF
FB17-FB20 = FERRITE 120R 3A 0603: as FB13-FB16 on sheet Motor-Z; DISTRIBUTOR #: 1276-6351-2-ND; DISTRIBUTOR: Digikey; PART: FERRITE 120R 3A 0603; PART DESCRIPTION: FERRITE BEAD 120 OHM 0603 1LN
J12 = Molex 0705430003 PIP: as J10 on sheet Motor-Z
R14 = RC0402FR-0710RL: as R8 on sheet Motor-Z; VALUE: 10R; MANUFACTURER #: RC0402FR-0710RL; DISTRIBUTOR #: 311-10.0LRTR-ND; DISTRIBUTOR: Digi-Key; PART: 10R
R25 R26 = 0.12R 1% 1206: as R15 on sheet Motor-Z; DISTRIBUTOR #: 311-.12LYTR-ND; DISTRIBUTOR: Digi-Key; EE_SPEC: 0.12R 1% 1206; PART: 0.12R; VALUE: 0.12R
R78 = RC0402FR-0710KP: as R77 on sheet Motor-Z; VALUE: 10K; MANUFACTURER #: RC0402FR-0710KP; DISTRIBUTOR #: YAG1249TR-ND; DISTRIBUTOR: Digi-Key; TOLERANCE: 1%
RN1 RN2 = 5.6k x 4 5% 1206: as RN1 on sheet Motor-Z; VALUE: 5.6k; DISTRIBUTOR #: CAY16-562J4LFCT-ND; DISTRIBUTOR: Digi-Key; EE_SPEC: 5.6k x 4 5% 1206; PART: 5.6k
RN3 = CAY16-103J4LF: as RN3 on sheet Motor-Z; VALUE: 10K; MANUFACTURER #: CAY16-103J4LF; DISTRIBUTOR #: CAY16-103J4LFTR-ND; DISTRIBUTOR: Digi-Key; PART: 10K
TP9 TP10 TP14 TP19 TP52 TP59 TP60 TP70 = TestPoint: Test Point
U7 = TMC2130-LA-T: as U6 on sheet Motor-Z; DISTRIBUTOR #: 1460-1130-2-ND; DISTRIBUTOR: Digi-Key; MANUFACTURER #: TMC2130-LA-T; PART: TMC2130; VALUE: TMC2130

## Nets that join several sheets
+12V2: Power-SMPS (C60.1 C103.1 D8.K F2.2), Heaters (11 pins)
+12V3: Power-SMPS (6 pins), Heaters (D10.K R58.1 TP16.TP)
FGND: Power-SMPS (8 pins), MCU (S1.3 S1.4), USB-Serial (D16.C)
GND: Power-SMPS (35 pins), MCU (20 pins), USB-Serial (5 pins), Connectors (9 pins), Endstops (24 pins), Heaters (26 pins), Motor-X (27 pins), Motor-Y (23 pins), Motor-Z (28 pins), Motor-E (27 pins)
VCC: Power-SMPS (7 pins), MCU (5 pins), USB-Serial (5 pins), Connectors (10 pins), Endstops (18 pins), Heaters (11 pins), Motor-X (R52.2), Motor-Y (R54.2), Motor-Z (R77.2), Motor-E (R78.2)
VCC-MOT: Power-SMPS (FB4.2 TP8.TP), Motor-X (7 pins), Motor-Y (7 pins), Motor-Z (7 pins), Motor-E (7 pins)
VMOT: Power-SMPS (8 pins), Motor-X (6 pins), Motor-Y (6 pins), Motor-Z (6 pins), Motor-E (6 pins)
BED-HEAT: MCU (U2.1), Heaters (R56.1)
BED-OUT: Power-SMPS (J1.6), Heaters (D10.A LED6.C Q5.MB TP18.TP)
E0-DIR: MCU (U2.41), Motor-E (U7.7)
E0-EN: MCU (U2.74), Motor-E (U7.22)
E0-STEP: MCU (U2.56), Motor-E (U7.6)
E0_DIAG: MCU (U2.86), Motor-E (R78.1 U7.20 U7.21)
E0_nCS: MCU (U2.85), Motor-E (U7.2)
E-REF-PWM: MCU (U2.40), Motor-E (RN1.1)
FAN-0: MCU (U2.17), Heaters (R21.1)
FAN-1: MCU (U2.15), Heaters (R48.1)
HEAT-0: MCU (U2.7), Heaters (R42.1)
MISO: MCU (U2.22), Connectors (R19.1 TP34.TP X1.1), Motor-X (U4.5), Motor-Y (U5.5), Motor-Z (U6.5), Motor-E (U7.5)
MOSI: MCU (RV8.2), Connectors (P2.5 TP36.TP X1.4), Motor-X (U4.4), Motor-Y (U5.4), Motor-Z (U6.4), Motor-E (U7.4)
nRESET: MCU (6 pins), Connectors (P2.3 TP37.TP X1.5)
PC5: MCU (U2.58), Connectors (FB25.2)
PD5: MCU (U2.48), Connectors (FB33.2)
PF6: MCU (U2.91), Heaters (R60.1 RT1.2)
PG3: MCU (U2.28), Connectors (FB36.2)
PG4: MCU (U2.29), Connectors (FB35.2)
PH2: MCU (U2.14), Connectors (FB40.1)
PH6: MCU (U2.18), Connectors (FB24.2)
PH7: MCU (U2.27), Connectors (FB41.1)
PJ2: MCU (U2.65), Connectors (FB37.1)
PJ5: MCU (U2.68), Connectors (FB31.1)
PK0: MCU (U2.89), Connectors (FB32.2)
RST-IO: MCU (C10.1), USB-Serial (TP29.TP U10.14)
RX0: MCU (U2.2), USB-Serial (TP30.TP U10.12)
RX1: MCU (U2.45), Connectors (FB34.1)
RX2: MCU (U2.12), Connectors (FB28.1)
RX3: MCU (U2.63), Connectors (FB23.1)
SCK: MCU (RV18.2), Connectors (P2.9 TP55.TP X1.3), Motor-X (U4.3), Motor-Y (U5.3), Motor-Z (U6.3), Motor-E (U7.3)
SCL: MCU (U2.43), Connectors (FB29.2)
SD_SS: MCU (R34.1), Connectors (FB38.2 U8.1)
SDA: MCU (U2.44), Connectors (FB30.2)
TACH_0: MCU (U2.8), Heaters (C42.1 R44.1)
TACH_1: MCU (U2.9), Heaters (C43.1 R45.1)
THERM0: MCU (U2.97), Heaters (C59.1 R6.2)
THERM1: MCU (U2.96), Heaters (C56.1 R37.2)
THERM2: MCU (U2.95), Heaters (C4.1 R39.2)
TX0: MCU (U2.3), USB-Serial (TP31.TP U10.11)
TX1: MCU (U2.46), Connectors (FB26.1)
TX2: MCU (U2.13), Connectors (FB27.1)
TX3: MCU (U2.64), Connectors (FB39.1)
X-DIR: MCU (U2.35), Motor-X (U4.7)
X-EN: MCU (U2.71), Motor-X (U4.22)
X-STEP: MCU (U2.53), Motor-X (U4.6)
X_DIAG: MCU (U2.87), Motor-X (R52.1 U4.20 U4.21)
X_MAX: MCU (U2.47), Endstops (RV11.2 RV36.1)
X_MIN: MCU (U2.25), Endstops (RV3.2 RV33.1)
X_nCS: MCU (U2.51), Motor-X (U4.2)
XTRA_0: MCU (U2.49), USB-Serial (TP11.TP U10.13)
XY-REF: Motor-X (6 pins), Motor-Y (U5.23)
XY-REF-PWM: MCU (U2.38), Motor-X (RN1.4)
Y-DIR: MCU (U2.36), Motor-Y (U5.7)
Y-EN: MCU (U2.72), Motor-Y (U5.22)
Y-STEP: MCU (U2.54), Motor-Y (U5.6)
Y_DIAG: MCU (U2.82), Motor-Y (R54.1 U5.20 U5.21)
Y_MAX: MCU (U2.94), Endstops (RV13.2 RV37.1)
Y_MIN: MCU (U2.24), Endstops (RV5.2 RV34.1)
Y_nCS: MCU (U2.70), Motor-Y (U5.2)
Z-DIR: MCU (U2.37), Motor-Z (U6.7)
Z-EN: MCU (U2.73), Motor-Z (U6.22)
Z-REF-PWM: MCU (U2.39), Motor-Z (RN1.2)
Z-STEP: MCU (U2.55), Motor-Z (U6.6)
Z_DIAG: MCU (U2.83), Motor-Z (R77.1 U6.20 U6.21)
Z_MAX: MCU (U2.16), Endstops (RV23.2 RV38.1)
Z_MIN: MCU (U2.23), Endstops (RV7.2 RV35.1)
Z_nCS: MCU (U2.84), Motor-Z (U6.2)